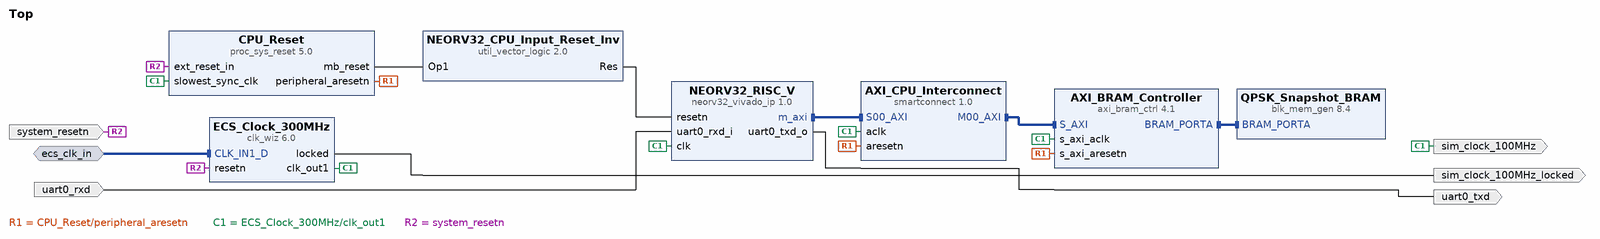
[diagram p0: block diagram of the top level]
# Vivado block design Top, xcau15p-ffvb676-2-e, Vivado 2025.2
create_bd_design Top

create_bd_intf_port -mode Slave -vlnv xilinx.com:interface:diff_clock_rtl:1.0 ecs_clk_in
set_property -dict {CONFIG.FREQ_HZ 300000000} [get_bd_intf_ports ecs_clk_in]
create_bd_port -dir I -type rst system_resetn
create_bd_port -dir O sim_clock_100MHz_locked
create_bd_port -dir O -type clk sim_clock_100MHz
create_bd_port -dir I uart0_rxd
create_bd_port -dir O uart0_txd

create_bd_cell -type ip -vlnv NEORV32:user:neorv32_vivado_ip:1.0 NEORV32_RISC_V
set_property -dict [list \
  CONFIG.BOOT_MODE_SELECT 2 \
  CONFIG.CLOCK_FREQUENCY 100000000 \
  CONFIG.CPU_FAST_MUL_EN true \
  CONFIG.CPU_FAST_SHIFT_EN true \
  CONFIG.DMEM_EN true \
  CONFIG.DMEM_SIZE 16384 \
  CONFIG.IMEM_EN true \
  CONFIG.IMEM_SIZE 32768 \
  CONFIG.IO_CLINT_EN true \
  CONFIG.IO_GPIO_EN true \
  CONFIG.IO_GPIO_IN_NUM 8 \
  CONFIG.IO_GPIO_OUT_NUM 8 \
  CONFIG.IO_SPI_EN true \
  CONFIG.IO_SPI_FIFO 4 \
  CONFIG.IO_TRACER_BUFFER 32 \
  CONFIG.IO_TRACER_EN true \
  CONFIG.IO_TRACER_SIMLOG_EN true \
  CONFIG.IO_UART0_EN true \
  CONFIG.IO_UART0_RX_FIFO 32 \
  CONFIG.IO_UART0_TX_FIFO 32 \
  CONFIG.RISCV_ISA_C true \
  CONFIG.RISCV_ISA_M true \
  CONFIG.RISCV_ISA_Zicntr true \
  CONFIG.XBUS_EN true \
  CONFIG.XBUS_TIMEOUT 255 \
] [get_bd_cells NEORV32_RISC_V]
create_bd_cell -type ip -vlnv xilinx.com:ip:clk_wiz:6.0 ECS_Clock_300MHz
set_property -dict [list \
  CONFIG.AUTO_PRIMITIVE PLL \
  CONFIG.CLKIN1_JITTER_PS 33.330000000000005 \
  CONFIG.CLKOUT1_DRIVES Buffer \
  CONFIG.CLKOUT1_JITTER 143.207 \
  CONFIG.CLKOUT1_PHASE_ERROR 114.212 \
  CONFIG.CLKOUT2_DRIVES Buffer \
  CONFIG.CLKOUT3_DRIVES Buffer \
  CONFIG.CLKOUT4_DRIVES Buffer \
  CONFIG.CLKOUT5_DRIVES Buffer \
  CONFIG.CLKOUT6_DRIVES Buffer \
  CONFIG.CLKOUT7_DRIVES Buffer \
  CONFIG.FEEDBACK_SOURCE FDBK_AUTO \
  CONFIG.MMCM_BANDWIDTH OPTIMIZED \
  CONFIG.MMCM_CLKFBOUT_MULT_F 8 \
  CONFIG.MMCM_CLKIN1_PERIOD 3.333 \
  CONFIG.MMCM_CLKIN2_PERIOD 10.0 \
  CONFIG.MMCM_CLKOUT0_DIVIDE_F 8 \
  CONFIG.MMCM_COMPENSATION AUTO \
  CONFIG.MMCM_DIVCLK_DIVIDE 3 \
  CONFIG.OPTIMIZE_CLOCKING_STRUCTURE_EN true \
  CONFIG.PRIMITIVE Auto \
  CONFIG.PRIM_IN_FREQ 300.000 \
  CONFIG.PRIM_SOURCE Differential_clock_capable_pin \
  CONFIG.RESET_BOARD_INTERFACE system_resetn \
  CONFIG.RESET_PORT resetn \
  CONFIG.RESET_TYPE ACTIVE_LOW \
  CONFIG.USE_LOCKED true \
  CONFIG.USE_RESET true \
] [get_bd_cells ECS_Clock_300MHz]
create_bd_cell -type ip -vlnv xilinx.com:ip:proc_sys_reset:5.0 CPU_Reset
create_bd_cell -type ip -vlnv xilinx.com:ip:util_vector_logic:2.0 NEORV32_CPU_Input_Reset_Inv
set_property -dict {CONFIG.C_OPERATION not CONFIG.C_SIZE 1} [get_bd_cells NEORV32_CPU_Input_Reset_Inv]
create_bd_cell -type ip -vlnv xilinx.com:ip:smartconnect:1.0 AXI_CPU_Interconnect
set_property -dict {CONFIG.NUM_MI 1 CONFIG.NUM_SI 1} [get_bd_cells AXI_CPU_Interconnect]
create_bd_cell -type ip -vlnv xilinx.com:ip:axi_bram_ctrl:4.1 AXI_BRAM_Controller
set_property -dict {CONFIG.PROTOCOL AXI4 CONFIG.READ_LATENCY 2 CONFIG.SINGLE_PORT_BRAM 1} [get_bd_cells AXI_BRAM_Controller]
create_bd_cell -type ip -vlnv xilinx.com:ip:blk_mem_gen:8.4 QPSK_Snapshot_BRAM
set_property -dict [list \
  CONFIG.Coe_File ../../../../../../sim/qpsk_bram_init.coe \
  CONFIG.Enable_32bit_Address true \
  CONFIG.Enable_A Always_Enabled \
  CONFIG.Fill_Remaining_Memory_Locations true \
  CONFIG.Load_Init_File true \
  CONFIG.Register_PortA_Output_of_Memory_Core false \
  CONFIG.Register_PortA_Output_of_Memory_Primitives true \
  CONFIG.Remaining_Memory_Locations FF \
  CONFIG.Use_RSTA_Pin false \
  CONFIG.use_bram_block Stand_Alone \
] [get_bd_cells QPSK_Snapshot_BRAM]

# ---- connections ----

connect_bd_intf_net [get_bd_intf_pins AXI_BRAM_Controller/BRAM_PORTA] [get_bd_intf_pins QPSK_Snapshot_BRAM/BRAM_PORTA]
connect_bd_intf_net [get_bd_intf_pins AXI_BRAM_Controller/S_AXI] [get_bd_intf_pins AXI_CPU_Interconnect/M00_AXI]
connect_bd_intf_net -intf_net CLK_IN1_D_0_1 [get_bd_intf_ports ecs_clk_in] [get_bd_intf_pins ECS_Clock_300MHz/CLK_IN1_D]
connect_bd_intf_net [get_bd_intf_pins NEORV32_RISC_V/m_axi] [get_bd_intf_pins AXI_CPU_Interconnect/S00_AXI]
connect_bd_net [get_bd_pins CPU_Reset/mb_reset] [get_bd_pins NEORV32_CPU_Input_Reset_Inv/Op1]
connect_bd_net [get_bd_pins CPU_Reset/peripheral_aresetn] [get_bd_pins AXI_CPU_Interconnect/aresetn] [get_bd_pins AXI_BRAM_Controller/s_axi_aresetn]
connect_bd_net [get_bd_pins ECS_Clock_300MHz/clk_out1] \
  [get_bd_ports sim_clock_100MHz] [get_bd_pins CPU_Reset/slowest_sync_clk] [get_bd_pins NEORV32_RISC_V/clk] \
  [get_bd_pins AXI_CPU_Interconnect/aclk] [get_bd_pins AXI_BRAM_Controller/s_axi_aclk]
connect_bd_net [get_bd_pins ECS_Clock_300MHz/locked] [get_bd_ports sim_clock_100MHz_locked]
connect_bd_net [get_bd_pins NEORV32_CPU_Input_Reset_Inv/Res] [get_bd_pins NEORV32_RISC_V/resetn]
connect_bd_net [get_bd_pins NEORV32_RISC_V/uart0_txd_o] [get_bd_ports uart0_txd]
connect_bd_net -net resetn_0_1 [get_bd_ports system_resetn] [get_bd_pins ECS_Clock_300MHz/resetn] [get_bd_pins CPU_Reset/ext_reset_in]
connect_bd_net -net uart0_rxd_i_0_1 [get_bd_ports uart0_rxd] [get_bd_pins NEORV32_RISC_V/uart0_rxd_i]

# ---- address map ----
assign_bd_address -offset 0xC0000000 -range 32K -target_address_space [get_bd_addr_spaces NEORV32_RISC_V/m_axi] [get_bd_addr_segs AXI_BRAM_Controller/S_AXI/Mem0]

validate_bd_design
save_bd_design
